# Altium schematic sheet Connectors.SchDoc
size A
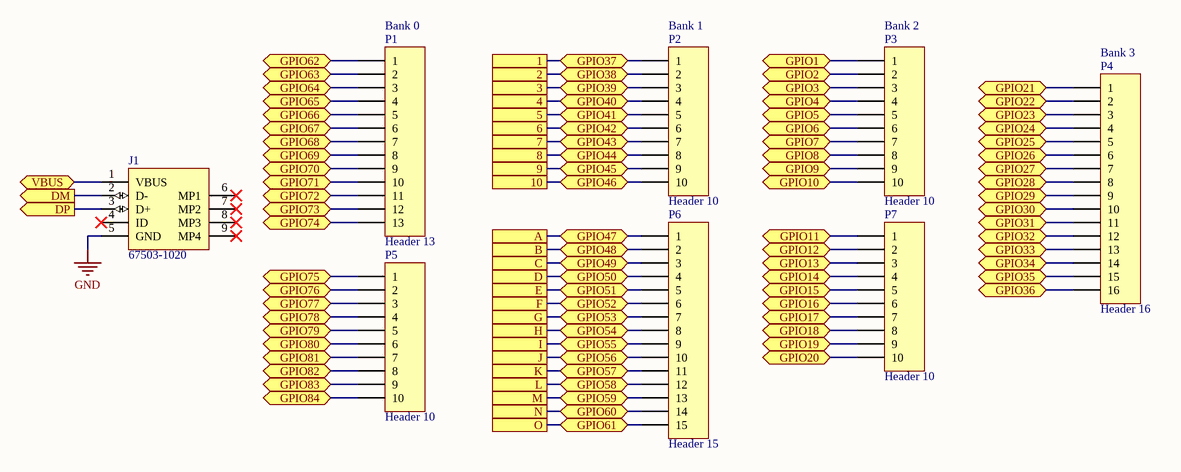
[diagram p0: Connectors.SchDoc]

## Parts
J1  67503-1020  [MOLX-67503-1020_V]
P1  Header 13  [HDR1X13]
P2  Header 10  [HDR1X10]
P3  Header 10  [HDR1X10]
P4  Header 16  [HDR1X16]
P5  Header 10  [HDR1X10]
P6  Header 15  [HDR1X15]
P7  Header 10  [HDR1X10]

## Ports
1, 2, 3, 4, 5, 6, 7, 8, 9, 10, A, B, C, D, DM (out), DP (out), E, F, G, GPIO1 (bidir), GPIO2 (bidir), GPIO3 (bidir), GPIO4 (bidir), GPIO5 (bidir), GPIO6 (bidir), GPIO7 (bidir), GPIO8 (bidir), GPIO9 (bidir), GPIO10 (bidir), GPIO11 (bidir), GPIO12 (bidir), GPIO13 (bidir), GPIO14 (bidir), GPIO15 (bidir), GPIO16 (bidir), GPIO17 (bidir), GPIO18 (bidir), GPIO19 (bidir), GPIO20 (bidir), GPIO21 (bidir), GPIO22 (bidir), GPIO23 (bidir), GPIO24 (bidir), GPIO25 (bidir), GPIO26 (bidir), GPIO27 (bidir), GPIO28 (bidir), GPIO29 (bidir), GPIO30 (bidir), GPIO31 (bidir), GPIO32 (bidir), GPIO33 (bidir), GPIO34 (bidir), GPIO35 (bidir), GPIO36 (bidir), GPIO37 (bidir), GPIO38 (bidir), GPIO39 (bidir), GPIO40 (bidir), GPIO41 (bidir), GPIO42 (bidir), GPIO43 (bidir), GPIO44 (bidir), GPIO45 (bidir), GPIO46 (bidir), GPIO47 (bidir), GPIO48 (bidir), GPIO49 (bidir), GPIO50 (bidir), GPIO51 (bidir), GPIO52 (bidir), GPIO53 (bidir), GPIO54 (bidir), GPIO55 (bidir), GPIO56 (bidir), GPIO57 (bidir), GPIO58 (bidir), GPIO59 (bidir), GPIO60 (bidir), GPIO61 (bidir), GPIO62 (bidir), GPIO63 (bidir), GPIO64 (bidir), GPIO65 (bidir), GPIO66 (bidir), GPIO67 (bidir), GPIO68 (bidir), GPIO69 (bidir), GPIO70 (bidir), GPIO71 (bidir), GPIO72 (bidir), GPIO73 (bidir), GPIO74 (bidir), GPIO75 (bidir), GPIO76 (bidir), GPIO77 (bidir), GPIO78 (bidir), GPIO79 (bidir), GPIO80 (bidir), GPIO81 (bidir), GPIO82 (bidir), GPIO83 (bidir), GPIO84 (bidir), H, I, J, K, L, M, N, O, VBUS (bidir)

## Nets
GND: J1.5(GND)
1: P2.1 ; port GPIO37, port 1
2: P2.2 ; port GPIO38, port 2
3: P2.3 ; port GPIO39, port 3
4: P2.4 ; port GPIO40, port 4
5: P2.5 ; port GPIO41, port 5
6: P2.6 ; port GPIO42, port 6
7: P2.7 ; port GPIO43, port 7
8: P2.8 ; port GPIO44, port 8
9: P2.9 ; port GPIO45, port 9
10: P2.10 ; port GPIO46, port 10
A: P6.1 ; port GPIO47, port A
B: P6.2 ; port GPIO48, port B
C: P6.3 ; port GPIO49, port C
D: P6.4 ; port GPIO50, port D
DM: J1.2(D-) ; port DM
DP: J1.3(D+) ; port DP
E: P6.5 ; port GPIO51, port E
F: P6.6 ; port GPIO52, port F
G: P6.7 ; port GPIO53, port G
GPIO1: P3.1 ; port GPIO1
GPIO2: P3.2 ; port GPIO2
GPIO3: P3.3 ; port GPIO3
GPIO4: P3.4 ; port GPIO4
GPIO5: P3.5 ; port GPIO5
GPIO6: P3.6 ; port GPIO6
GPIO7: P3.7 ; port GPIO7
GPIO8: P3.8 ; port GPIO8
GPIO9: P3.9 ; port GPIO9
GPIO10: P3.10 ; port GPIO10
GPIO11: P7.1 ; port GPIO11
GPIO12: P7.2 ; port GPIO12
GPIO13: P7.3 ; port GPIO13
GPIO14: P7.4 ; port GPIO14
GPIO15: P7.5 ; port GPIO15
GPIO16: P7.6 ; port GPIO16
GPIO17: P7.7 ; port GPIO17
GPIO18: P7.8 ; port GPIO18
GPIO19: P7.9 ; port GPIO19
GPIO20: P7.10 ; port GPIO20
GPIO21: P4.1 ; port GPIO21
GPIO22: P4.2 ; port GPIO22
GPIO23: P4.3 ; port GPIO23
GPIO24: P4.4 ; port GPIO24
GPIO25: P4.5 ; port GPIO25
GPIO26: P4.6 ; port GPIO26
GPIO27: P4.7 ; port GPIO27
GPIO28: P4.8 ; port GPIO28
GPIO29: P4.9 ; port GPIO29
GPIO30: P4.10 ; port GPIO30
GPIO31: P4.11 ; port GPIO31
GPIO32: P4.12 ; port GPIO32
GPIO33: P4.13 ; port GPIO33
GPIO34: P4.14 ; port GPIO34
GPIO35: P4.15 ; port GPIO35
GPIO36: P4.16 ; port GPIO36
GPIO54: P6.8 ; port GPIO54, port H
GPIO55: P6.9 ; port GPIO55, port I
GPIO56: P6.10 ; port GPIO56, port J
GPIO57: P6.11 ; port GPIO57, port K
GPIO58: P6.12 ; port GPIO58, port L
GPIO59: P6.13 ; port GPIO59, port M
GPIO60: P6.14 ; port GPIO60, port N
GPIO61: P6.15 ; port GPIO61, port O
GPIO62: P1.1 ; port GPIO62
GPIO63: P1.2 ; port GPIO63
GPIO64: P1.3 ; port GPIO64
GPIO65: P1.4 ; port GPIO65
GPIO66: P1.5 ; port GPIO66
GPIO67: P1.6 ; port GPIO67
GPIO68: P1.7 ; port GPIO68
GPIO69: P1.8 ; port GPIO69
GPIO70: P1.9 ; port GPIO70
GPIO71: P1.10 ; port GPIO71
GPIO72: P1.11 ; port GPIO72
GPIO73: P1.12 ; port GPIO73
GPIO74: P1.13 ; port GPIO74
GPIO75: P5.1 ; port GPIO75
GPIO76: P5.2 ; port GPIO76
GPIO77: P5.3 ; port GPIO77
GPIO78: P5.4 ; port GPIO78
GPIO79: P5.5 ; port GPIO79
GPIO80: P5.6 ; port GPIO80
GPIO81: P5.7 ; port GPIO81
GPIO82: P5.8 ; port GPIO82
GPIO83: P5.9 ; port GPIO83
GPIO84: P5.10 ; port GPIO84
VBUS: J1.1(VBUS) ; port VBUS

Not connected (* = marked no-connect by the designer): J1 4(ID)* 6(MP1)* 7(MP2)* 8(MP3)* 9(MP4)*

## Notes on the sheet
- (near P1) Bank 0
- (near P2) Bank 1
- (near P3) Bank 2
- (near P4) Bank 3

## Library data of the parts
J1 = CMP-0411-00002-1: USB, MINI, SMD, RA KME04-USBMU03A01; Manufacturer: Molex; ComponentLink1URL: http://www.molex.com/; PartNumber: 67503-1020; Mounting Technology: Surface Mount; ComponentLink1Description: Manufacturer URL; Terminal Pitch: 0.8 mm; DatasheetVersion: Rev F, 06/2009; ComponentLink2Description: Datasheet; PackageDescription: Mini USB Connector, SMT, Righer Angle; ComponentLink2URL: http://www.molex.com/pdm_docs/sd/675031020_sd.pdf; PackageReference: 67503-1020
P1 = Header 13: Header, 13-Pin; LatestRevisionDate: 17-Jul-2002; LatestRevisionNote: Re-released for DXP Platform.; Publisher: Altium Limited
P2 P3 P5 P7 = Header 10: Header, 10-Pin; LatestRevisionDate: 17-Jul-2002; LatestRevisionNote: Re-released for DXP Platform.; Publisher: Altium Limited
P4 = Header 16: Header, 16-Pin; LatestRevisionDate: 17-Jul-2002; LatestRevisionNote: Re-released for DXP Platform.; Publisher: Altium Limited
P6 = Header 15: Header, 15-Pin; LatestRevisionDate: 17-Jul-2002; LatestRevisionNote: Re-released for DXP Platform.; Publisher: Altium Limited